# EAGLE design adapter_board_max86916 (EAGLE 9.6.2)
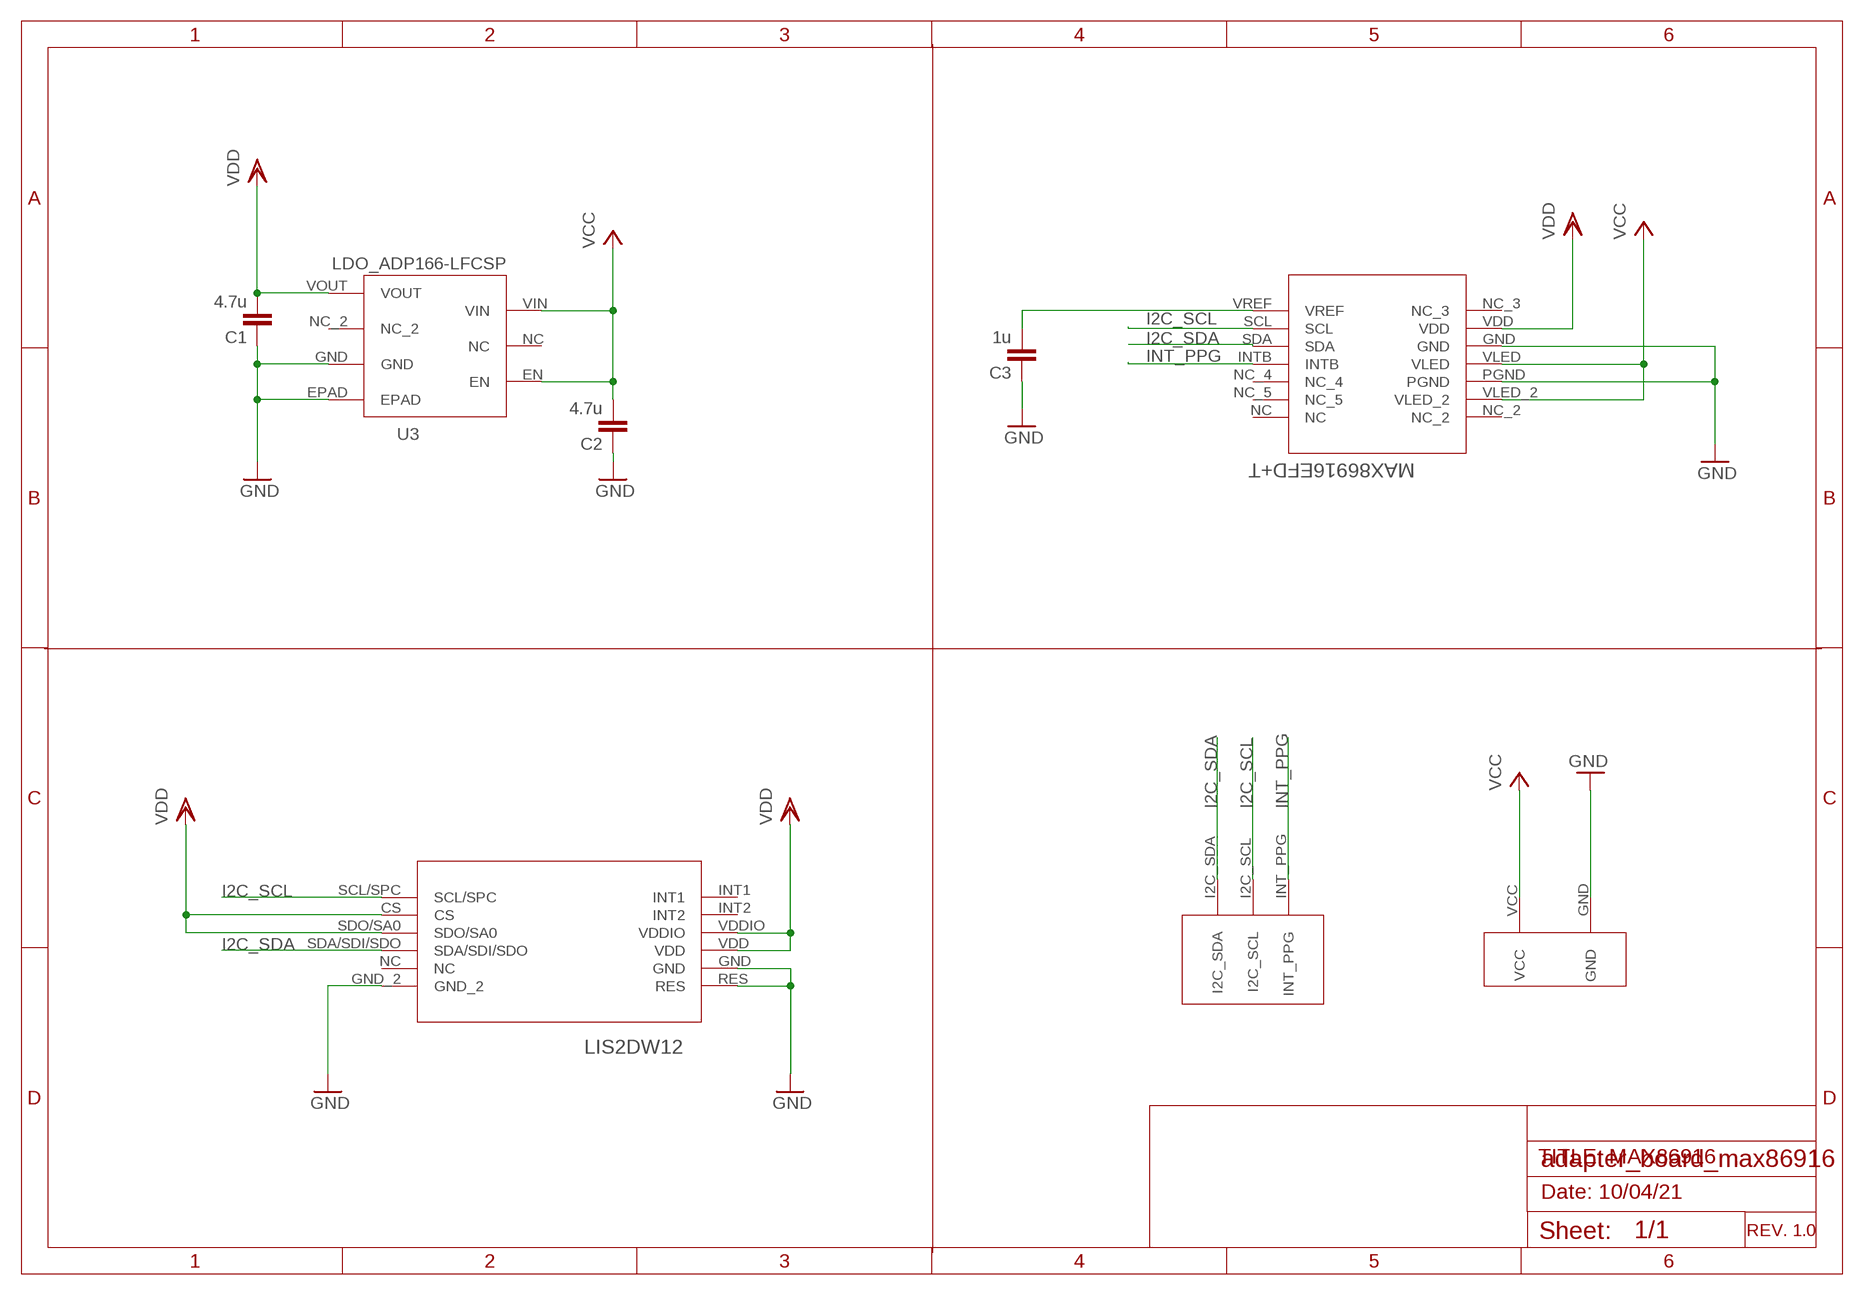
[diagram p0: schematic, sheet 1]
FRAME1 (A4L-LOC): DATE_TIME: Date: 10/04/21; REV: REV. 1.0; TITLE: TITLE: MAX86916

## Parts
C1  4.7u  221E_PASSIVES_C0402  [221E_PASSIVES_C0402]
C2  4.7u  221E_PASSIVES_C0402  [221E_PASSIVES_C0402]
C3  1u  221E_PASSIVES_C0402  [221E_PASSIVES_C0402]
U1  MAX86916EFD+T  [21-100325_90-100122]
U2  LIS2DW12  [LIS2DW12_LGA-12_2X2X0P7_STM]
U3  LDO_ADP166-LFCSP  [ADP166-LFCSP]
U$1  PAD_2  [PAD_2]
U$2  PAD_3  [PAD_3]

## Nets
GND: C1.P$1 C2.P$1 C3.P$1 U1.GND U1.PGND U2.GND U2.GND_2 U2.RES U3.EPAD U3.GND U$1.GND
I2C_SCL: U1.SCL U2.SCL/SPC U$2.I2C_SCL
I2C_SDA: U1.SDA U2.SDA/SDI/SDO U$2.I2C_SDA
INT_PPG: U1.INTB U$2.INT_PPG
N$1: C3.P$2 U1.VREF
VCC: C2.P$2 U1.VLED U1.VLED_2 U3.EN U3.VIN U$1.VCC
VDD: C1.P$2 U1.VDD U2.CS U2.SDO/SA0 U2.VDD U2.VDDIO U3.VOUT
Unconnected: U1.NC U1.NC_2 U1.NC_3 U1.NC_4 U1.NC_5 U2.INT1 U2.INT2 U2.NC U3.NC U3.NC_2

## Library data of the parts
C1-C3 = PPG:221E_PASSIVES_C
U1 = max86916:MAX86916EFD+T: Max86916 eagle component, it's a ppg sensor with 4 different leds; BUILT_BY: EMA_Rebekah; COPYRIGHT: Copyright (C) 2018 Accelerated Designs. All rights reserved; MANUFACTURER_PART_NUMBER: MAX86916EFD+T; SOURCELIBRARY: Maxim_2020-05-05; VENDOR: Maxim Integrated Products
U2 = LIS2DW12:LIS2DW12
U3 = LDO_ADP166:LDO_ADP166-LFCSP; SPICEPREFIX: X
U$1 = PADS:PAD_2: PADs
U$2 = PADS:PAD_3

## Board
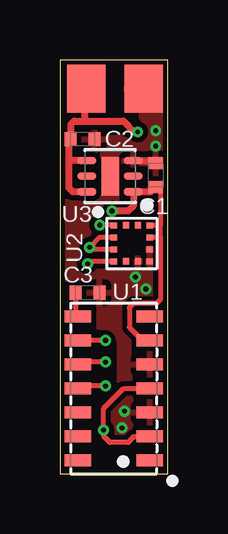
[diagram p1: board, top side]
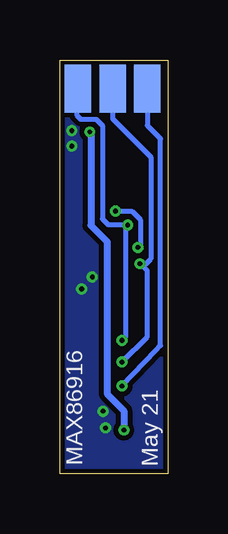
[diagram p2: board, bottom side, seen from below]

Size 4.5 x 17.25 mm. Coordinates in mm from the lower left corner, seen from the top.
Outline: 0,0 4.5,0 4.5,17.25 0,17.25 0,0
Copper layers (1*16): Top 0.035mm / dielectric 1.5mm / Bottom 0.035mm
Design rules "default *": minimum track width 0.2mm, minimum drill 0.2mm, track to track 0.2mm, track to pad 0.2mm, pad to pad 0.2mm, via to via 0.2mm, smd to smd 0.2mm, copper to edge 0.2mm, drill to drill 0.2mm, minimum pad ring 0.15mm, minimum via ring 5mil, stop-mask expansion 4mil, vias tented up to drill 0mil, thermal gap 10mil
tRestrict: 18 lines

### Footprints (pad centres in the part's own frame; a part is rotated, then mirrored left to right if it is on the bottom)
221E_PASSIVES_C0402 = smd 0.5 x 0.6: P$1 -0.5,0; P$2 0.5,0
21-100325_90-100122 = smd 1.1 x 0.5: GND -1.5,-1; INTB 1.5,0; NC 1.5,3; NC_2 -1.5,3; NC_3 -1.5,-3; NC_4 1.5,1; NC_5 1.5,2; PGND -1.5,1; SCL 1.5,-2; SDA 1.5,-1; VDD -1.5,-2; VLED -1.5,0; VLED_2 -1.5,2; VREF 1.5,-3
LIS2DW12_LGA-12_2X2X0P7_STM = smd 0.275 x 0.25: CS -0.75,0.25; GND 0.75,-0.25; RES 0.75,-0.75; SCL/SPC -0.75,0.75; SDA/SDI/SDO -0.75,-0.75; SDO/SA0 -0.75,-0.25; VDD 0.75,0.25; VDDIO 0.75,0.75 | smd 0.25 x 0.275: GND_2 0.25,-0.75; INT1 -0.25,0.75; INT2 0.25,0.75; NC -0.25,-0.75
ADP166-LFCSP = smd 0.798 x 0.32: EN 0.966,-0.65; GND -0.966,-0.65; NC 0.966,0; NC_2 -0.966,0; VIN 0.966,0.65; VOUT -0.966,0.65 | smd 0.73 x 1.6: EPAD 0,0
PAD_2 = smd 1.6 x 2: GND 1.2,1.2; VCC -1.2,1.2
PAD_3 = smd 1.1 x 2: I2C_SCL 1.45,1.2; I2C_SDA 0,1.2; INT_PPG -1.45,1.2

### Placement (x,y rotation side)
C1  4,12.45 270 top
C2  0.95,13.95 180 top
C3  1.15,7.55 180 top
U1  2.25,3.55 180 top
U2  3,9.6 0 top
U3  2.1,12.4 180 top
U$1  2.3,14.85 0 top
U$2  2.3,17.25 180 bottom

### Tracks (layer width: path | path; a pad name or v marks a point on that pad's centre or on a via)
GND  (via drill 0.2)
  Top 0.3: U3.GND 3.9,13.05 C1.P$1
  other vias: 4,13.65 3.6,7.7 2.7,2.6 2.6,1.9 3.15,8.2 4,14.3
  pour Top: 0,17.25 0,0 4.5,0 4.5,17.25
  pour Bottom: 0,17.25 0,0 4.5,0 4.5,17.25
  pour Top (no thermals): 3.35,15.15 3.35,14.8 3.4,14.75 3.8,14.35 4.25,14.35 4.25,15.15
I2C_SCL  (via drill 0.2)
  Top 0.2: v1.9,5.55 U1.SCL | U2.SCL/SPC 2.23,10.37 v1.67,10.37
  Bottom 0.2: U$2.I2C_SCL 3.8,16 3.8,14.95 3.63,14.78 2.98,14.78 2.72,14.52 2.72,10.62 2.47,10.37 v1.67,10.37 1.77,10.27 1.77,5.68 v1.9,5.55
I2C_SDA  (via drill 0.2)
  Top 0.2: v1.9,4.65 0.77,4.65 U1.SDA | U2.SDA/SDI/SDO 1.25,8.85 v1.15,8.75
  Bottom 0.2: U$2.I2C_SDA 2.3,14.8 0.7,13.2 0.7,8.95 0.9,8.75 v1.15,8.75 0.85,8.45 0.85,5.7 v1.9,4.65
INT_PPG  (via drill 0.2)
  Top 0.2: v1.9,3.65 0.76,3.65 U1.INTB
  Bottom 0.2: v1.9,3.65 0.5,5.14 0.3,5.34 0.3,13.97 0.85,14.52 U$2.INT_PPG
N$1
  Top 0.2: C3.P$2 0.65,6.65 U1.VREF
VCC  (via drill 0.2)
  Top 0.2: U1.VLED 2.67,3.55 1.82,2.71 v1.82,1.81 1.82,1.56 2.09,1.3 2.85,1.3 3.1,1.55 U1.VLED_2
  Top 0.3: v3.25,14.25 3.1,14.25 2.65,14.7 1.05,14.7 | U3.VIN 0.55,11.75 0.39,11.91 0.39,13.05 | 0.39,13.05 0.39,13.88 C2.P$2 0.45,14.55 0.6,14.7 1.05,14.7 | U3.EN 0.39,13.05 | 1.05,14.7 1.05,16 U$1.VCC
  Bottom 0.3: v3.25,14.25 3.2,14.2 3.2,10.35 2.52,9.68 2.53,3.33 1.82,2.62 v1.82,1.81
VDD  (via drill 0.2)
  Top 0.2: U1.VDD 3.27,5.73 2.9,6.1 2.9,6.92 3.08,7.1 4.04,7.1 4.2,7.26 4.2,9.85 | 4.2,10.35 4.2,11.75 C1.P$2 3.8,11.75 | 4.2,10.35 U2.VDDIO | 4.2,9.85 U2.VDD | U2.SDO/SA0 1.32,9.35 v1.24,9.44 1.65,9.84 U2.CS | 4.2,9.85 4.2,10.35
  Top 0.3: 3.8,11.75 U3.VOUT 3.07,11.17 2.85,10.95 v2.18,10.95
  Bottom 0.2: v1.24,9.44 1.14,9.54 1.14,10.59 1.5,10.94 v2.18,10.94 v2.18,10.95

### Text on the board
bNames: MAX86916 | May 21